# EAGLE design AdafruitVEML6075 (EAGLE 8.1.1)
AUTHOR: KTOWN
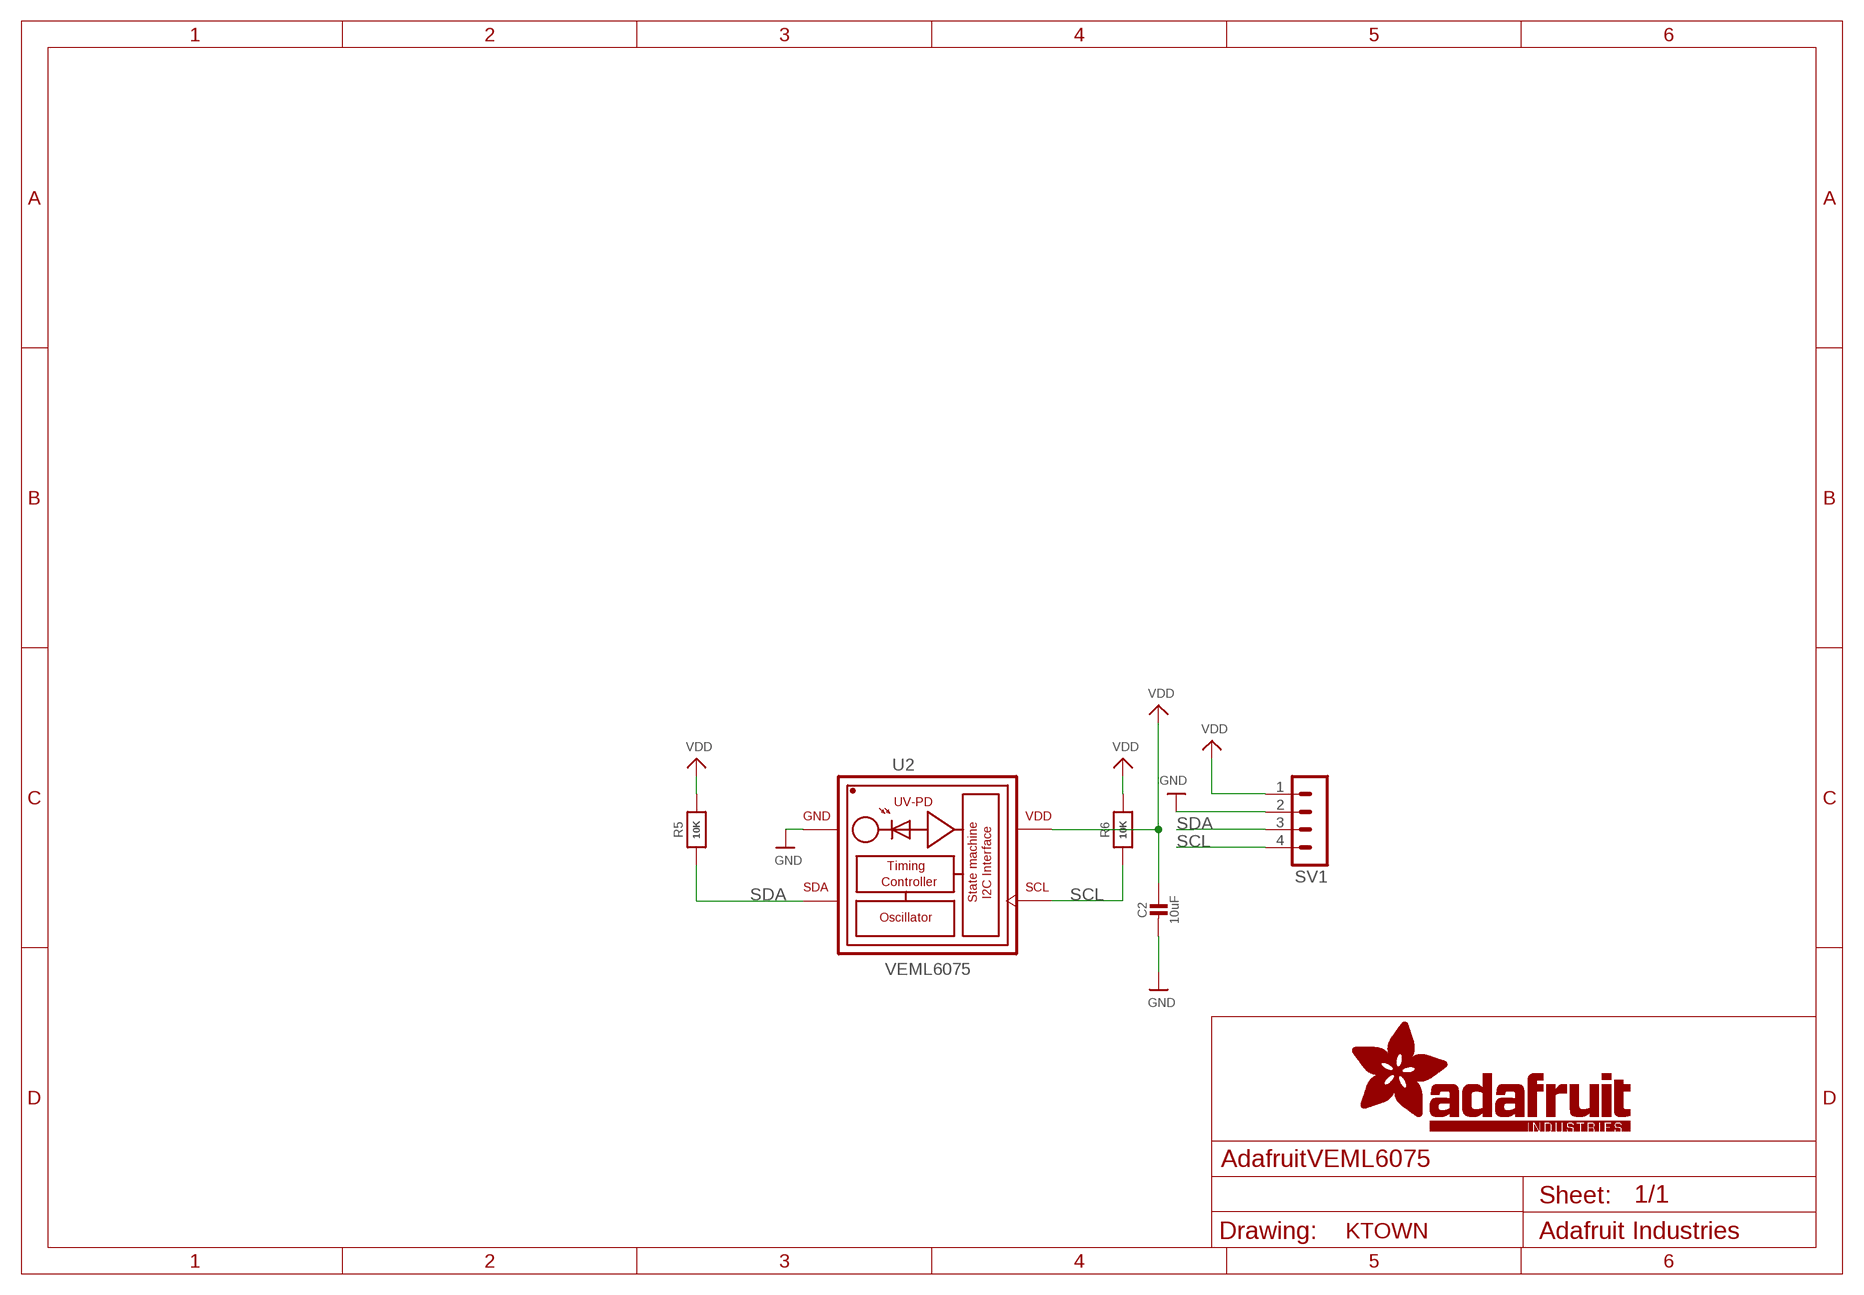
[diagram p0: schematic, sheet 1]

## Parts
C2  10uF  CAP_CERAMIC0805-NOOUTLINE  [0805-NO]
R5  10K  RESISTOR0805_NOOUTLINE  [0805-NO]
R6  10K  RESISTOR0805_NOOUTLINE  [0805-NO]
SV1  MA04-1  [MA04-1]
U2  VEML6075  [VISHAY_VEML6075_1.25X2X1]

## Nets
GND: C2.2 SV1.2 U2.1(GND)
SCL: R6.1 SV1.4 U2.3(SCL)
SDA: R5.1 SV1.3 U2.2(SDA)
VDD: C2.1 R5.2 R6.2 SV1.1

## Power pins joined to a net without a drawn wire
VDD: U2.4(VDD)

## Library data of the parts
C2 = microbuilder:CAP_CERAMIC: Ceramic Capacitors For new designs, use the packages preceded by an '_' character since they are more reliable: The following footprints should be used on most boards: _0402 - Standard footprint for regular board layouts _0603 - Standard footprint for regular board layouts _0805 - Standard footprint for regular board layouts _1206 - Standard footprint for regular board layouts For extremely tight-pitch boards where space is at a premium, the following 'micro-pitch' footprints can be used (smaller pads, no silkscreen outline, etc.): _0402MP - Micro-pitch footprint for very dense/compact boards _0603MP - Micro-pitch footprint for very dense/compact boards _0805MP - Micro-pitch footprint for very dense/compact boards _1206MP - Micro-pitch footprint for very dense/compact boards
R5 R6 = microbuilder:RESISTOR: Resistors For new designs, use the packages preceded by an '_' character since they are more reliable: The following footprints should be used on most boards: _0402 - Standard footprint for regular board layouts _0603 - Standard footprint for regular board layouts _0805 - Standard footprint for regular board layouts _1206 - Standard footprint for regular board layouts For extremely tight-pitch boards where space is at a premium, the following 'micro-pitch' footprints can be used (smaller pads, no silkscreen outline, etc.): _0402MP - Micro-pitch footprint for very dense/compact boards _0603MP - Micro-pitch footprint for very dense/compact boards _0805MP - Micro-pitch footprint for very dense/compact boards _1206MP - Micro-pitch footprint for very dense/compact boards
SV1 = con-lstb:MA04-1: PIN HEADER; OC_FARNELL: unknown; OC_NEWARK: unknown
U2 = VEML6075:VEML6075: VEML6075 UVA and UVB Light Sensor with I2C Interface: The VEML6075 senses UVA and UVB light and incorporates photodiode, amplifiers, and analog / digital circuits into a single chip using a CMOS process. When the UV sensor is applied, it is able to detect UVA and UVB intensity to provide a measure of the signal strength as well as allowing for UVI measurement. Device Model created 15.06.2016 by Johannes Kolb - Vishay Semiconductor GmbH; AVAILABILITY: Good; DESCRIPTION: VEML6075 Series 2 x 1.25 x 1 mm 330/365 nm SMT I2C UVA/UVB Light Sensor; MF: Vishay; MP: VEML6075; PACKAGE: None; PRICE: 1.42 USD

## Board
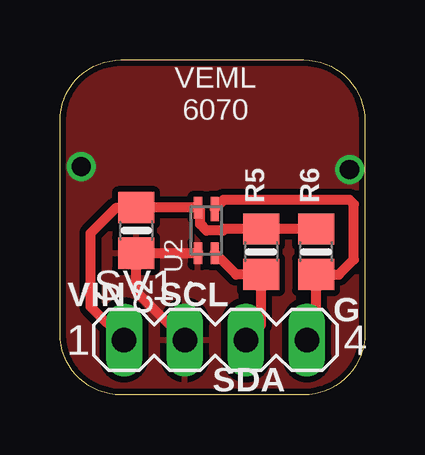
[diagram p1: board, top side]
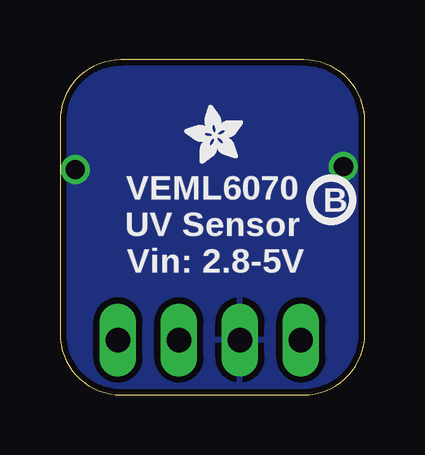
[diagram p2: board, bottom side, seen from below]

Size 12.7 x 13.97 mm. Coordinates in mm from the lower left corner, seen from the top.
Outline: 12.7,11.43 12.7,2.54 arc-90 10.16,0 2.54,0 arc-90 0,2.54 0,11.43 arc-90 2.54,13.97 10.16,13.97 arc-90 12.7,11.43
Copper layers (1*16): Top 0.035mm / dielectric 1.5mm / Bottom 0.035mm
Design rules "adafruit": minimum track width 8mil, minimum drill 15.5mil, track to track 8mil, track to pad 8mil, pad to pad 8mil, via to via 8mil, smd to smd 8mil, copper to edge 10mil, drill to drill 8mil, minimum pad ring 10mil, minimum via ring 8mil, stop-mask expansion 2mil, vias tented up to drill 20mil, thermal gap 10mil

### Footprints (pad centres in the part's own frame; a part is rotated, then mirrored left to right if it is on the bottom)
0805-NO = smd 1.3 x 1.5: 1 -0.95,0; 2 0.95,0
MA04-1 = drill 1.016 long: 1 -3.81,0; 2 -1.27,0; 3 1.27,0; 4 3.81,0
VISHAY_VEML6075_1.25X2X1 = smd 0.9 x 0.35: 1 -0.95,0.35; 2 -0.95,-0.35; 4 0.95,0.35 | smd 1 x 0.35: 3 0.9,-0.35

### Placement (x,y rotation side)
C2  3.17,6.86 270 top
R5  8.38,5.97 90 top
R6  10.67,5.97 90 top
SV1  6.48,2.29 0 top
U2  6.1,6.86 90 top
U$2  [PCBFEAT-REV-040]  1.4,8.13 0 bottom
U$14  [ADAFRUIT_2.5MM]  5.08,9.65 90 bottom

### Tracks (layer width: path | path; a pad name or v marks a point on that pad's centre or on a via)
GND  (via drill 0.8)
  Top 0.406: SV1.2 3.17,4.32 C2.2 U2.1
  other vias: 0.89,9.53 12.06,9.4
  pour Top (isolate 0.254): 0,0 0,13.97 12.7,13.97 12.7,0
  pour Bottom (isolate 0.254): 0,0 0,13.97 12.7,13.97 12.7,0
SCL
  Top 0.406: SV1.4 10.67,2.67 R6.1 11.62,5.02 12.24,5.64 12.24,7.95 12.06,8.13 6.82,8.13 U2.3
SDA
  Top 0.406: SV1.3 8.38,2.92 R5.1 7.33,5.02 U2.2
VDD
  Top 0.406: SV1.1 1.27,3.68 1.27,6.73 2.35,7.81 C2.1 U2.4 5.84,7.72 5.84,7.12 6.1,6.85 6.79,6.85 6.86,6.92 R5.2 R6.2

### Text on the board
tPlace: VEML / 6070 | ACK | VIN | SCL | G | SDA
bPlace: VEML6070 / UV Sensor | Vin: 2.8-5V